# EAGLE design flex_probe (EAGLE 9.5.2)
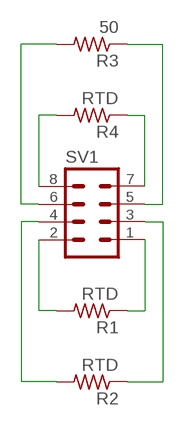
[diagram p0: schematic, sheet 1]

## Parts
R1  RTD  R-US_R0603  [R0603]
R2  RTD  R-US_R0603  [R0603]
R3  50  R-US_R0603  [R0603]
R4  RTD  R-US_R0603  [R0603]
SV1  MA04-2  [MA04-2]

## Nets
N$1: R1.2 SV1.2
N$2: R1.1 SV1.1
N$3: R2.2 SV1.4
N$4: R2.1 SV1.3
N$7: R4.1 SV1.7
N$8: R3.2 SV1.6
N$9: R3.1 SV1.5
N$11: R4.2 SV1.8

## Library data of the parts
R1-R4 = resistor:R-US_: RESISTOR, American symbol
SV1 = con-lstb:MA04-2: PIN HEADER; OC_FARNELL: unknown; OC_NEWARK: unknown

## Board
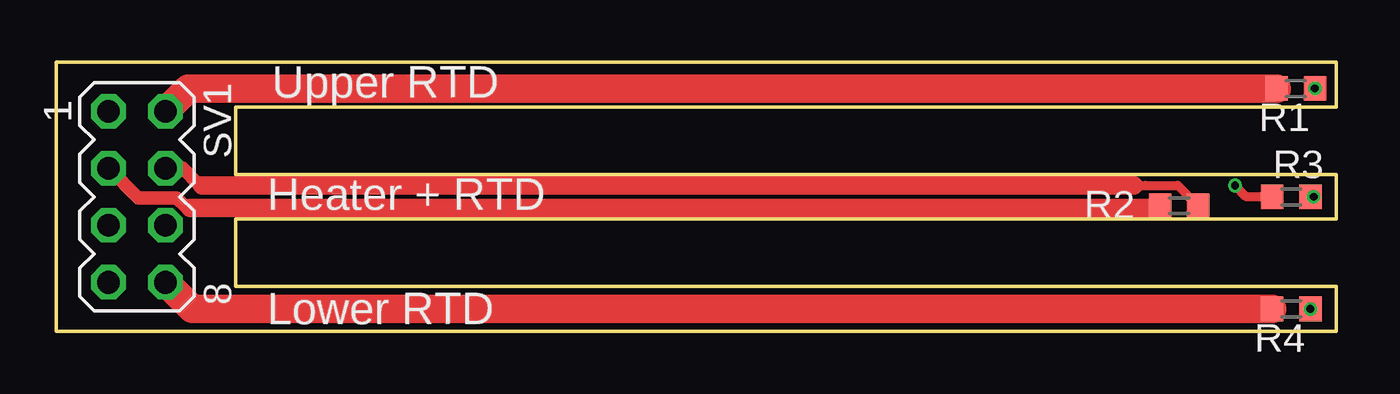
[diagram p1: board, top side]
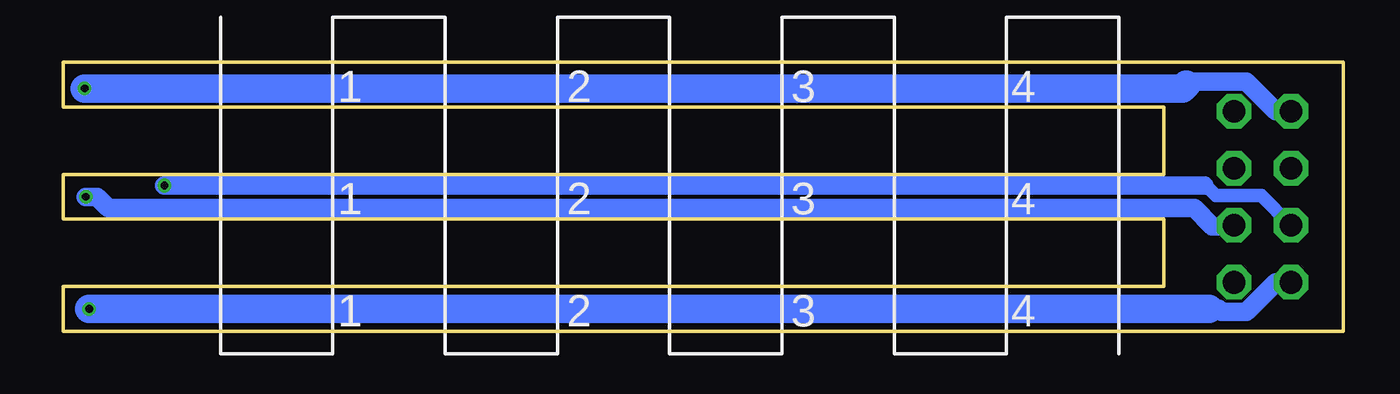
[diagram p2: board, bottom side, seen from below]

Size 57 x 12 mm. Coordinates in mm from the lower left corner, seen from the top.
Outline: 0,12 57,12 57,10 8,10 8,7 57,7 57,5 8,5 8,2 57,2 57,0 0,0 0,12
Copper layers (1*16): Top 0.035559375mm / dielectric 1.6mm / Bottom 0.035559375mm
Design rules "oshpark-2layer *": minimum track width 6mil, minimum drill 10mil, track to track 6mil, track to pad 6mil, pad to pad 6mil, via to via 6mil, smd to smd 6mil, copper to edge 0mil, drill to drill 6mil, minimum pad ring 5mil, minimum via ring 5mil, stop-mask expansion 2.5mil, vias tented up to drill 0mil, thermal gap 10mil

### Footprints (pad centres in the part's own frame; a part is rotated, then mirrored left to right if it is on the bottom)
R0603 = smd 1 x 1.1: 1 -0.85,0; 2 0.85,0
MA04-2 = drill 1.016 octagon: 1 -3.81,-1.27; 2 -3.81,1.27; 3 -1.27,-1.27; 4 -1.27,1.27; 5 1.27,-1.27; 6 1.27,1.27; 7 3.81,-1.27; 8 3.81,1.27

### Placement (x,y rotation side)
R1  55.2,10.83 180 top
R2  50,5.6 0 top
R3  55,6 0 top
R4  55,1 180 top
SV1  3.6,6 270 top

### Tracks (layer width: path | path; a pad name or v marks a point on that pad's centre or on a via)
N$1
  Top 1.27: R1.2 5.89,10.83 SV1.2
N$2  (via drill 0.35)
  Bottom 0.813: SV1.1 3,9.81 4.32,11.13 6.87,11.13 7,11
  Bottom 1.27: R1.1 7.17,10.83 7,11
  other vias: 56.05,10.83
N$3
  Top 0.406: R2.2 49.94,6.51 48.5,6.51 48.5,6.5 48,6.5
  Top 0.61: 6.5,6.5 6.4,6.5 5.63,7.27 SV1.4
  Top 0.813: 48,6.5 6.5,6.5
N$4
  Top 0.61: 5.97,5.5 5.82,5.5 5.38,5.95 3.65,5.95 SV1.3
  Top 0.813: R2.1 49.05,5.5 5.97,5.5
N$7  (via drill 0.35)
  Bottom 0.813: SV1.7 3,2.19 4.32,0.87 5.42,0.87 5.55,1 6,1
  Bottom 1.27: 6,1 R4.1
  other vias: 55.85,1
N$8  (via drill 0.35)
  Top 0.406: R3.2 v56,6
  Bottom 0.813: v56,6 55.5,6 55,5.5 6.65,5.5 5.83,4.69 4.91,4.69 SV1.6
N$9  (via drill 0.35)
  Top 0.406: R3.1 53,6 v52.5,6.5
  Bottom 0.61: 6.6,6.5 6.12,6.5 5.67,6.05 3.65,6.05 SV1.5
  Bottom 0.813: 6.18,6.5 6.6,6.5 v52.5,6.5
N$11
  Top 1.27: R4.2 6.06,1 SV1.8

### Text on the board
tNames: Upper RTD | Heater + RTD | Lower RTD
bNames: 4 | 3 | 2 | 1 | 4 | 3 | 2 | 1 | 4 | 3 | 2 | 1